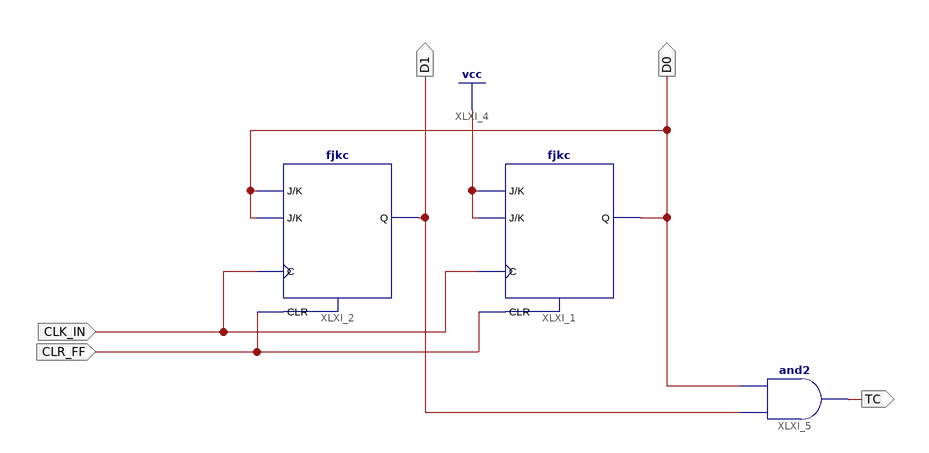
[diagram p0: schematic sheet 1]
// Xilinx ISE schematic Counter_UP_0_3_withTC.sch (spartan6) as structural Verilog: 3 symbols, 5 ports
module Counter_UP_0_3_withTC (
  input  CLK_IN,
  input  CLR_FF,
  output D0,
  output D1,
  output TC
);

  fjkc XLXI_1 (.C(CLK_IN), .CLR(CLR_FF), .J(1'b1), .K(1'b1), .Q(D0));
  fjkc XLXI_2 (.C(CLK_IN), .CLR(CLR_FF), .J(D0), .K(D0), .Q(D1));
  and XLXI_5 (TC, D1, D0);
endmodule
